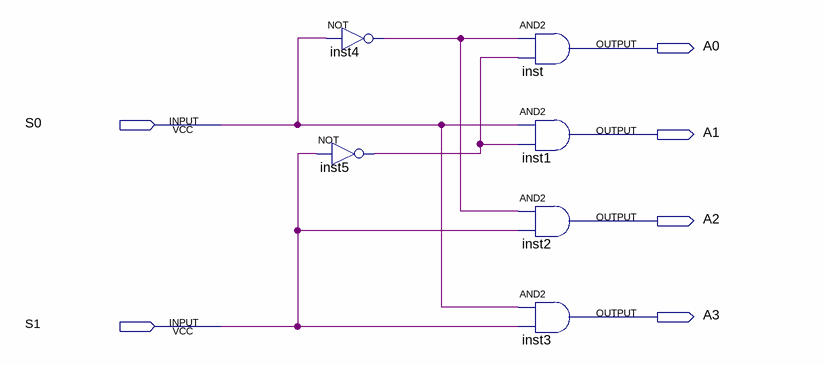
[diagram p0: schematic sheet]
// Quartus schematic DecEndMem.bdf as structural Verilog: 6 symbols, 6 pins
module DecEndMem (
  input  S0,
  input  S1,
  output A0,
  output A1,
  output A2,
  output A3
);

  wire inst4_out, inst5_out;

  not inst5 (inst5_out, S1);
  not inst4 (inst4_out, S0);
  and inst (A0, inst4_out, inst5_out);
  and inst1 (A1, S0, inst5_out);
  and inst2 (A2, inst4_out, S1);
  and inst3 (A3, S0, S1);
endmodule
